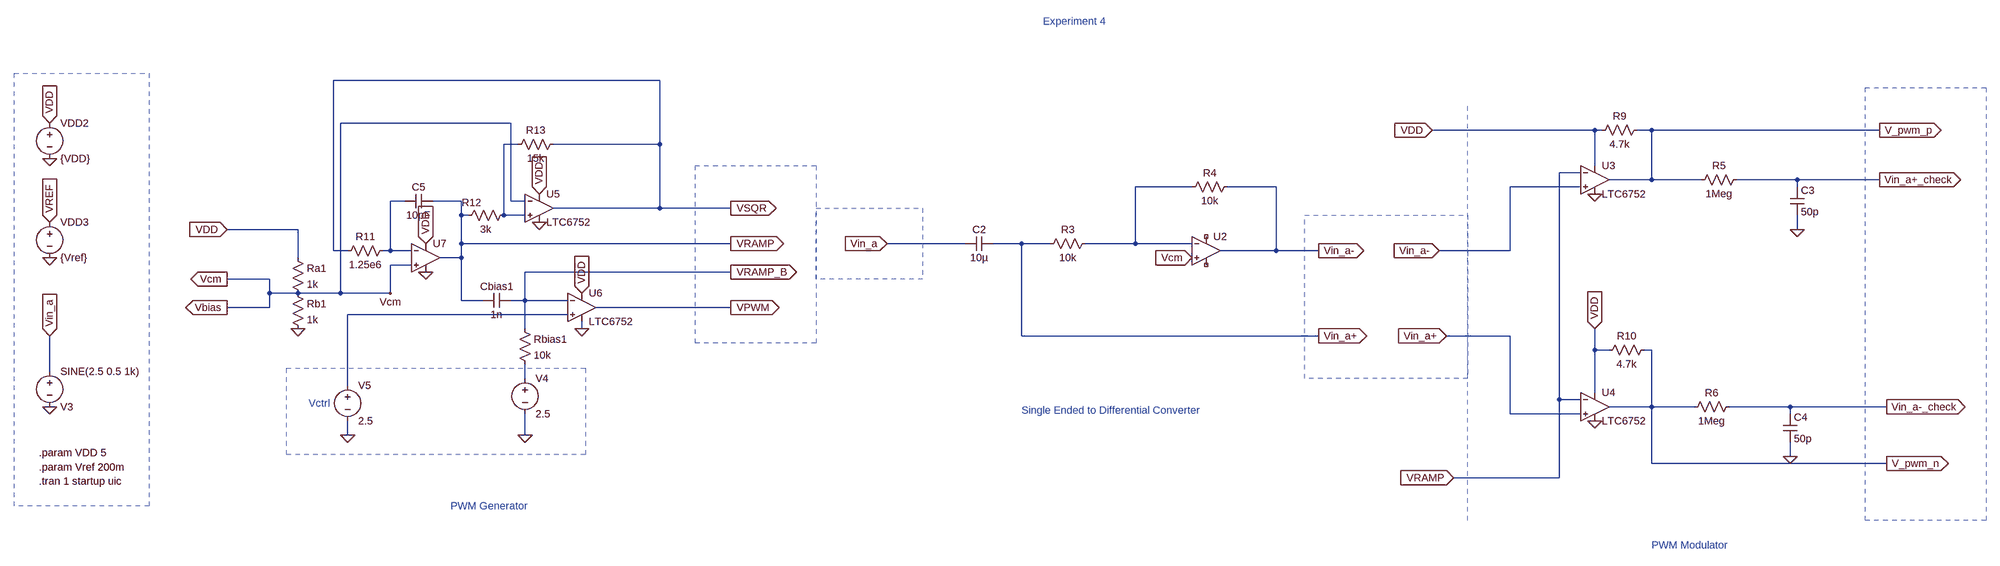
[diagram p0: schematic Ex 4.asc]
Ex 4.asc, the LTspice schematic file:
Version 4
SHEET 1 7392 1136
WIRE 1280 -80 544 -80
WIRE 944 16 560 16
WIRE 3520 32 3040 32
WIRE 3536 32 3520 32
WIRE 3648 32 3616 32
WIRE 4192 32 3648 32
WIRE 960 64 928 64
WIRE 1280 64 1280 -80
WIRE 1280 64 1040 64
WIRE 3520 112 3520 32
WIRE 3488 128 3440 128
WIRE 3648 144 3648 32
WIRE 3648 144 3552 144
WIRE 3760 144 3648 144
WIRE 4000 144 3840 144
WIRE 4192 144 4000 144
WIRE 2480 160 2352 160
WIRE 2688 160 2560 160
WIRE 3488 160 3216 160
WIRE 4000 160 4000 144
WIRE 704 192 672 192
WIRE 832 192 768 192
WIRE 944 192 944 16
WIRE 976 192 944 192
WIRE 1280 208 1280 64
WIRE 1280 208 1040 208
WIRE 1440 208 1280 208
WIRE 832 224 832 192
WIRE 848 224 832 224
WIRE 928 224 928 64
WIRE 976 224 928 224
WIRE 464 256 304 256
WIRE 4000 256 4000 224
WIRE 832 288 832 224
WIRE 1440 288 832 288
WIRE 1968 288 1792 288
WIRE 2096 288 2032 288
WIRE 2160 288 2096 288
WIRE 2352 288 2352 160
WIRE 2352 288 2240 288
WIRE 2480 288 2352 288
WIRE 544 304 544 -80
WIRE 576 304 544 304
WIRE 672 304 672 192
WIRE 672 304 656 304
WIRE 720 304 672 304
WIRE 2688 304 2688 160
WIRE 2688 304 2544 304
WIRE 2784 304 2688 304
WIRE 3216 304 3216 160
WIRE 3216 304 3056 304
WIRE 464 320 464 256
WIRE 832 320 832 288
WIRE 832 320 784 320
WIRE 720 336 672 336
WIRE 1440 352 976 352
WIRE 400 368 304 368
WIRE 400 400 400 368
WIRE 464 400 400 400
WIRE 560 400 560 16
WIRE 560 400 464 400
WIRE 672 400 672 336
WIRE 672 400 560 400
WIRE 832 416 832 320
WIRE 880 416 832 416
WIRE 976 416 976 352
WIRE 976 416 944 416
WIRE 1072 416 976 416
WIRE 400 432 400 400
WIRE 400 432 304 432
WIRE 1440 432 1136 432
WIRE 1072 448 576 448
WIRE 976 480 976 416
WIRE 1104 480 1104 464
WIRE 2096 496 2096 288
WIRE 2784 496 2096 496
WIRE 3216 496 3072 496
WIRE 3520 528 3520 480
WIRE 3552 528 3520 528
WIRE 3648 528 3632 528
WIRE -96 576 -96 496
WIRE 976 592 976 560
WIRE 576 608 576 448
WIRE 3520 624 3520 528
WIRE 3440 640 3440 128
WIRE 3488 640 3440 640
WIRE 3648 656 3648 528
WIRE 3648 656 3552 656
WIRE 3744 656 3648 656
WIRE 3984 656 3824 656
WIRE 4208 656 3984 656
WIRE 3216 672 3216 496
WIRE 3488 672 3216 672
WIRE 3984 672 3984 656
WIRE 576 720 576 688
WIRE 976 720 976 672
WIRE 3984 768 3984 736
WIRE 3648 784 3648 656
WIRE 4208 784 3648 784
WIRE 3440 816 3440 640
WIRE 3440 816 3088 816
FLAG 1792 288 Vin_a
IOPIN 1792 288 In
FLAG 2784 304 Vin_a-
IOPIN 2784 304 Out
FLAG 2784 496 Vin_a+
IOPIN 2784 496 Out
FLAG 3088 816 VRAMP
IOPIN 3088 816 In
FLAG 3056 304 Vin_a-
IOPIN 3056 304 In
FLAG 3072 496 Vin_a+
IOPIN 3072 496 In
FLAG 4192 32 V_pwm_p
IOPIN 4192 32 Out
FLAG 4208 784 V_pwm_n
IOPIN 4208 784 Out
FLAG 4000 256 0
FLAG 3984 768 0
FLAG 4192 144 Vin_a+_check
IOPIN 4192 144 Out
FLAG 4208 656 Vin_a-_check
IOPIN 4208 656 Out
FLAG 3040 32 VDD
IOPIN 3040 32 In
FLAG 3520 480 VDD
IOPIN 3520 480 In
FLAG 3520 176 0
FLAG 3520 688 0
FLAG -96 656 0
FLAG -96 496 Vin_a
IOPIN -96 496 In
FLAG 2480 320 Vcm
IOPIN 2480 320 In
FLAG 464 480 0
FLAG 1008 240 0
FLAG 752 352 0
FLAG 1104 480 0
FLAG 672 400 Vcm
FLAG 1440 208 VSQR
IOPIN 1440 208 Out
FLAG 1440 288 VRAMP
IOPIN 1440 288 Out
FLAG 752 288 VDD
IOPIN 752 288 In
FLAG 1008 176 VDD
IOPIN 1008 176 In
FLAG 1104 400 VDD
IOPIN 1104 400 In
FLAG 1440 432 VPWM
IOPIN 1440 432 Out
FLAG 1440 352 VRAMP_B
IOPIN 1440 352 Out
FLAG 304 256 VDD
IOPIN 304 256 In
FLAG -96 96 0
FLAG -96 16 VDD
IOPIN -96 16 In
FLAG -96 320 0
FLAG -96 240 VREF
IOPIN -96 240 In
FLAG 976 720 0
FLAG 576 720 0
FLAG 304 368 Vcm
IOPIN 304 368 Out
FLAG 304 432 Vbias
IOPIN 304 432 Out
SYMBOL cap 2032 272 R90
WINDOW 0 0 32 VBottom 2
WINDOW 3 32 32 VTop 2
SYMATTR InstName C2
SYMATTR Value 10µ
SYMBOL res 2256 272 R90
WINDOW 0 0 56 VBottom 2
WINDOW 3 32 56 VTop 2
SYMATTR InstName R3
SYMATTR Value 10k
SYMBOL res 2576 144 R90
WINDOW 0 0 56 VBottom 2
WINDOW 3 32 56 VTop 2
SYMATTR InstName R4
SYMATTR Value 10k
SYMBOL OpAmps\\UniversalOpAmp 2512 304 R0
SYMATTR InstName U2
SYMBOL Comparators\\LTC6752 3520 80 R0
SYMATTR InstName U3
SYMBOL Comparators\\LTC6752 3520 592 R0
SYMATTR InstName U4
SYMBOL res 3856 128 R90
WINDOW 0 0 56 VBottom 2
WINDOW 3 32 56 VTop 2
SYMATTR InstName R5
SYMATTR Value 1Meg
SYMBOL cap 3984 160 R0
SYMATTR InstName C3
SYMATTR Value 50p
SYMBOL res 3840 640 R90
WINDOW 0 0 56 VBottom 2
WINDOW 3 32 56 VTop 2
SYMATTR InstName R6
SYMATTR Value 1Meg
SYMBOL cap 3968 672 R0
SYMATTR InstName C4
SYMATTR Value 50p
SYMBOL res 3632 16 R90
WINDOW 0 0 56 VBottom 2
WINDOW 3 32 56 VTop 2
SYMATTR InstName R9
SYMATTR Value 4.7k
SYMBOL res 3648 512 R90
WINDOW 0 0 56 VBottom 2
WINDOW 3 32 56 VTop 2
SYMATTR InstName R10
SYMATTR Value 4.7k
SYMBOL voltage -96 560 R0
WINDOW 0 24 96 Left 2
WINDOW 3 24 16 Left 2
WINDOW 123 0 0 Left 0
WINDOW 39 0 0 Left 0
SYMATTR InstName V3
SYMATTR Value SINE(2.5 0.5 1k)
SYMBOL res 448 304 R0
SYMATTR InstName Ra1
SYMATTR Value 1k
SYMBOL res 448 384 R0
SYMATTR InstName Rb1
SYMATTR Value 1k
SYMBOL res 672 288 R90
WINDOW 0 0 56 VBottom 2
WINDOW 3 32 56 VTop 2
SYMATTR InstName R11
SYMATTR Value 1.25e6
SYMBOL cap 768 176 R90
WINDOW 0 0 32 VBottom 2
WINDOW 3 32 32 VTop 2
SYMATTR InstName C5
SYMATTR Value 10pF
SYMBOL res 944 208 R90
WINDOW 0 3 89 VBottom 2
WINDOW 3 32 56 VTop 2
SYMATTR InstName R12
SYMATTR Value 3k
SYMBOL res 1056 48 R90
WINDOW 0 0 56 VBottom 2
WINDOW 3 32 56 VTop 2
SYMATTR InstName R13
SYMATTR Value 15k
SYMBOL cap 944 400 R90
WINDOW 0 0 32 VBottom 2
WINDOW 3 32 32 VTop 2
SYMATTR InstName Cbias1
SYMATTR Value 1n
SYMBOL res 960 464 R0
SYMATTR InstName Rbias1
SYMATTR Value 10k
SYMBOL voltage 976 576 R0
WINDOW 123 0 0 Left 0
WINDOW 39 0 0 Left 0
SYMATTR InstName V4
SYMATTR Value 2.5
SYMBOL Comparators\\LTC6752 1008 144 R0
SYMATTR InstName U5
SYMBOL Comparators\\LTC6752 1104 368 R0
SYMATTR InstName U6
SYMBOL OpAmps\\UniversalOpamp2 752 320 R0
SYMATTR InstName U7
SYMBOL voltage -96 0 R0
WINDOW 123 0 0 Left 0
WINDOW 39 0 0 Left 0
SYMATTR InstName VDD2
SYMATTR Value {VDD}
SYMBOL voltage -96 224 R0
WINDOW 123 0 0 Left 0
WINDOW 39 0 0 Left 0
SYMATTR InstName VDD3
SYMATTR Value {Vref}
SYMBOL voltage 576 592 R0
WINDOW 123 0 0 Left 0
WINDOW 39 0 0 Left 0
SYMATTR InstName V5
SYMATTR Value 2.5
TEXT -120 824 Left 2 !.tran 1 startup uic
TEXT 2096 664 Left 2 ;Single Ended to Differential Converter
TEXT 3648 968 Left 2 ;PWM Modulator
TEXT -120 760 Left 2 !.param VDD 5
TEXT -120 792 Left 2 !.param Vref 200m
TEXT 488 648 Left 2 ;Vctrl
TEXT 808 880 Left 2 ;PWM Generator
TEXT 2144 -344 Left 2 ;Experiment 4
LINE Normal 3120 912 3120 -32 2
RECTANGLE Normal 1112 764 438 569 2
RECTANGLE Normal 1632 512 1360 112 2
RECTANGLE Normal 1872 368 1632 208 2
RECTANGLE Normal 3120 592 2752 224 2
RECTANGLE Normal 4432 912 4160 -64 2
RECTANGLE Normal 128 880 -176 -96 2

The netlist it stands for:
* Ex 4.asc
C2 Vin_a+ Vin_a 10µ
R3 N002 Vin_a+ 10k
R4 Vin_a- N002 10k
XU2 Vbias N002 NC_01 NC_02 Vin_a- level1 Avol=1Meg GBW=10Meg Vos=0 En=0 Enk=0 In=0 Ink=0 Rin=500Meg  ; pins In+ In- V+ V- OUT
XU3 Vin_a- VRAMP VDD 0 V_pwm_p LTC6752  ; pins In+ In- V+ V- OUT
XU4 Vin_a+ VRAMP VDD 0 V_pwm_n LTC6752  ; pins In+ In- V+ V- OUT
R5 Vin_a+_check V_pwm_p 1Meg
C3 Vin_a+_check 0 50p
R6 Vin_a-_check V_pwm_n 1Meg
C4 Vin_a-_check 0 50p
R9 V_pwm_p VDD 4.7k
R10 V_pwm_n VDD 4.7k
V3 Vin_a 0 SINE(2.5 0.5 1k)
Ra1 VDD Vbias 1k
Rb1 Vbias 0 1k
R11 N003 VSQR 1.25e6
C5 VRAMP N003 10pF
R12 N001 VRAMP 3k
R13 VSQR N001 15k
Cbias1 VRAMP_B VRAMP 1n
Rbias1 VRAMP_B N005 10k
V4 N005 0 2.5
XU5 N001 Vbias VDD 0 VSQR LTC6752  ; pins In+ In- V+ V- OUT
XU6 N004 VRAMP_B VDD 0 VPWM LTC6752  ; pins In+ In- V+ V- OUT
XU7 Vbias N003 VDD 0 VRAMP level.2 Avol=1Meg GBW=10Meg Slew=10Meg ilimit=25m rail=0 Vos=0 phimargin=45 en=0 enk=0 in=0 ink=0 Rin=500Meg  ; pins IN+ IN- V+ V- OUT
VDD2 VDD 0 {VDD}
VDD3 VREF 0 {Vref}
V5 N004 0 2.5
.tran 1 startup uic
* Single Ended to Differential Converter
* PWM Modulator
.param VDD 5
.param Vref 200m
* Vctrl
* PWM Generator
* Experiment 4
.lib UniversalOpAmp1.lib
.lib LTC7.lib
.lib UniversalOpamps2.sub
.backanno
.end